# Altium schematic sheet PWR_APD5052.SchDoc: Power: DCDC
size A3; Engineer: Samer Kilani; DocumentNumber: 1; SheetNumber: 1; SheetTotal: 9
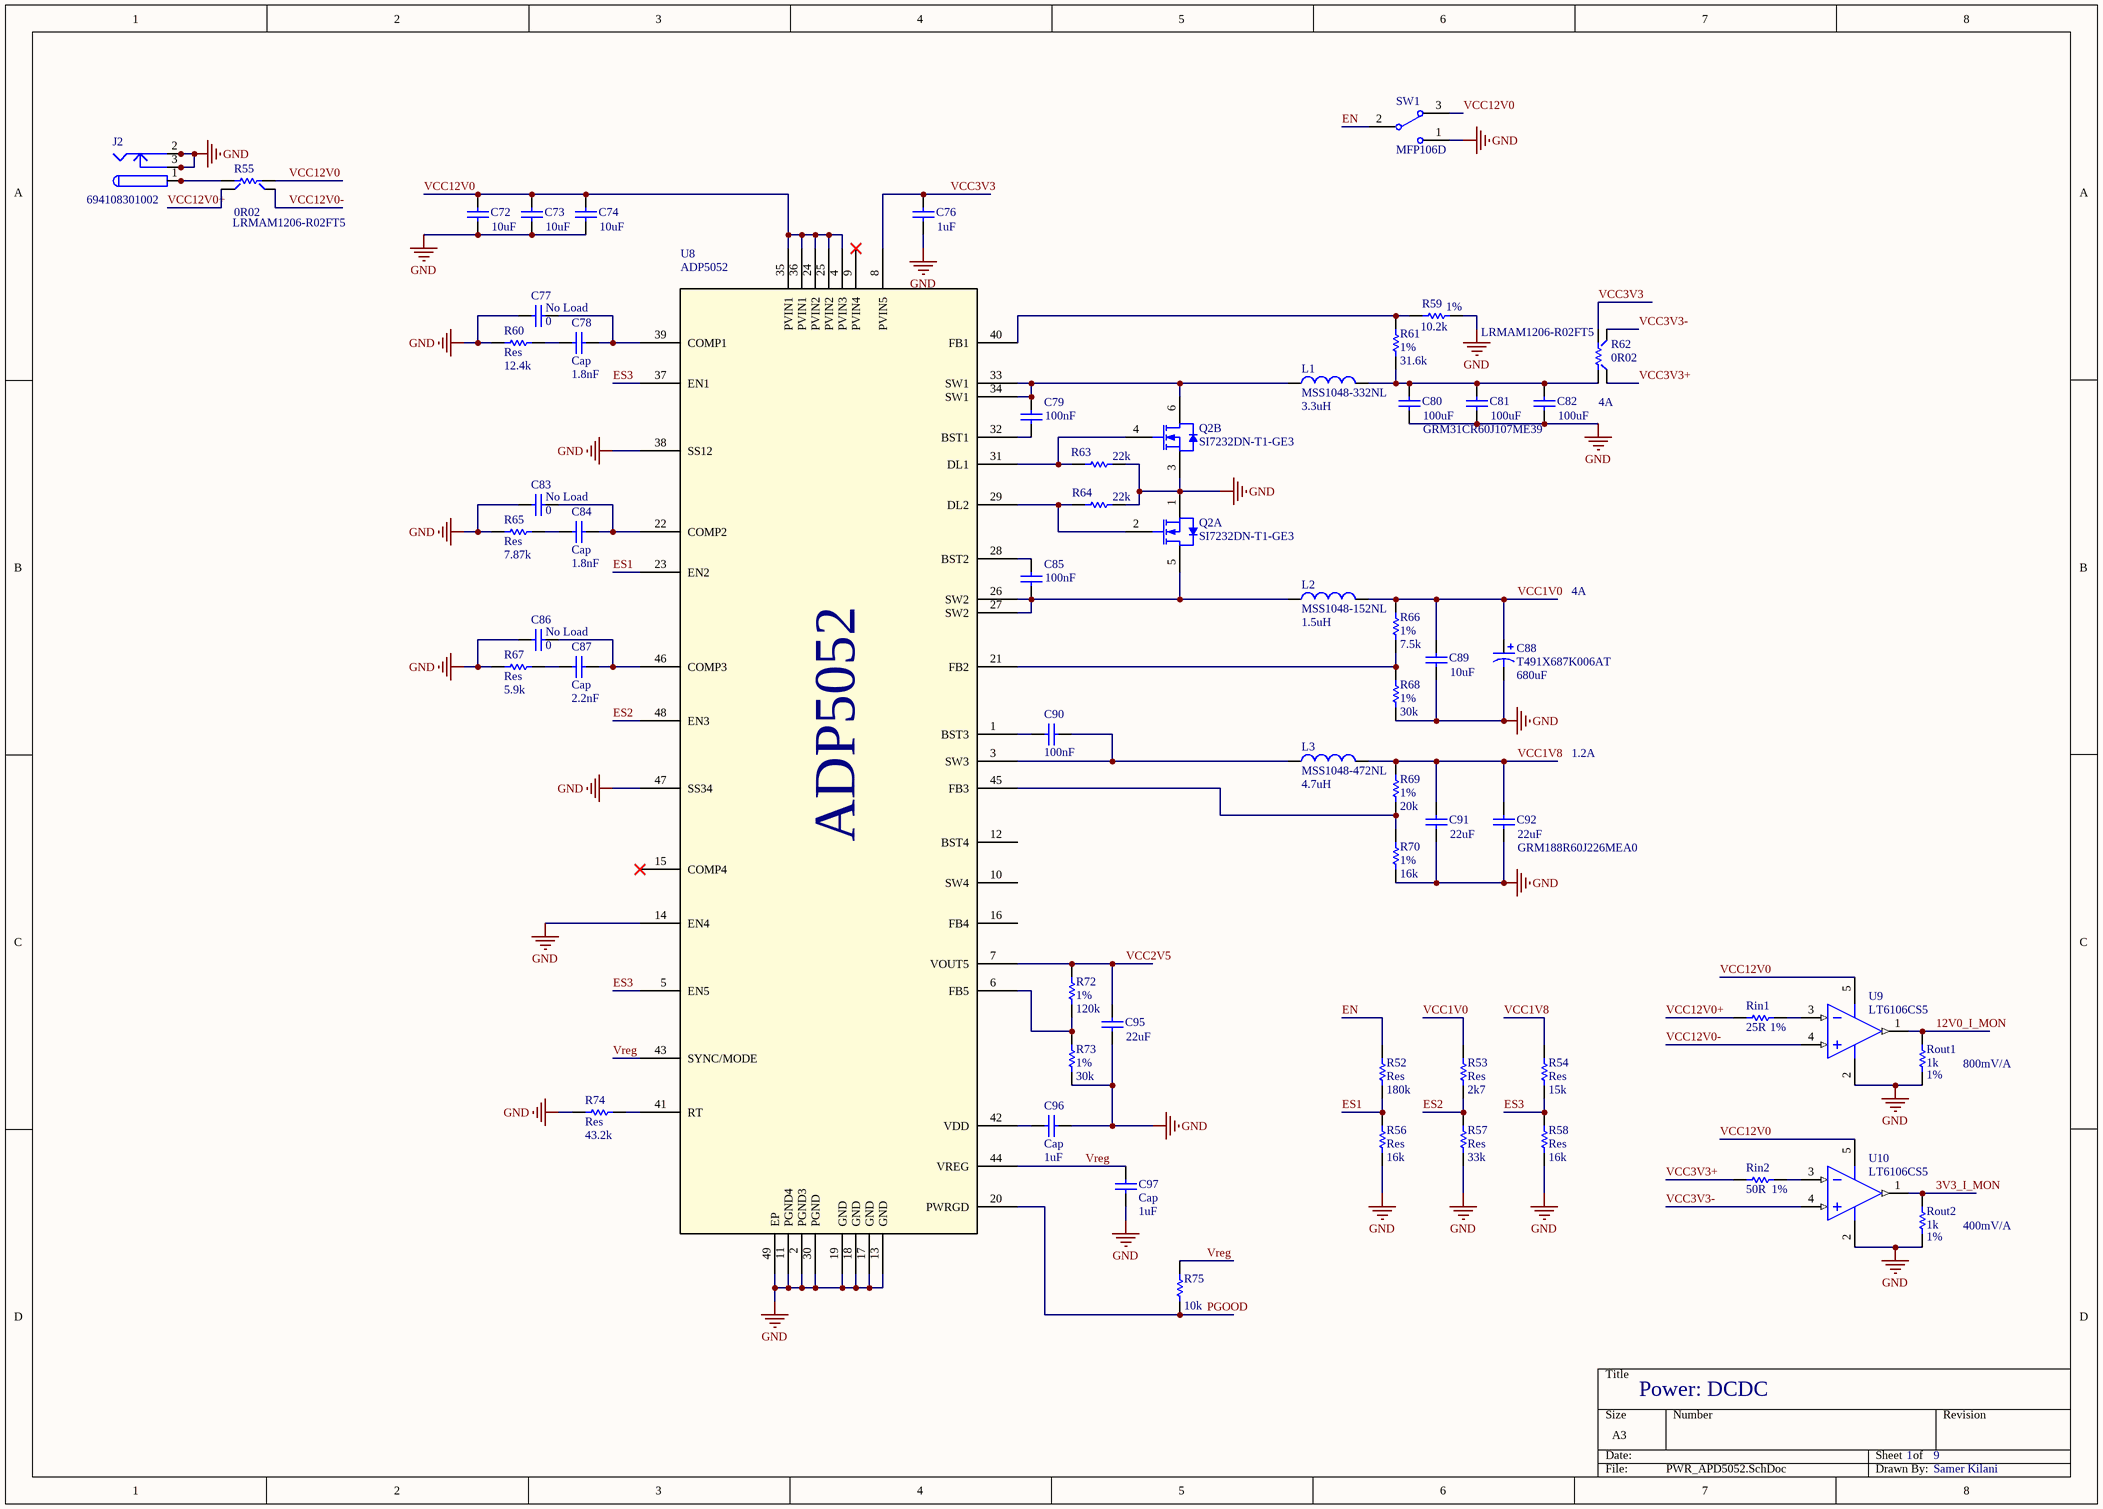
[diagram p0: PWR_APD5052.SchDoc]

## Parts
C72  value 10uF  [C0805]
C73  value 10uF  [C0805]
C74  value 10uF  [C0805]  (hidden comment: Cap)
C76  value 1uF  [C0402]
C77  No Load  value 0  [C0402]
C78  Cap  value 1.8nF  [C0402]
C79  value 100nF  [C0402]  (hidden comment: Cap)
C80  GRM31CR60J107ME39  value 100uF  [C1206]
C81  value 100uF  [C1206]  (hidden comment: GRM31CR60J107ME39)
C82  value 100uF  [C1206]  (hidden comment: GRM31CR60J107ME39)
C83  No Load  value 0  [C0402]
C84  Cap  value 1.8nF  [C0402]
C85  value 100nF  [C0402]  (hidden comment: Cap)
C86  No Load  value 0  [C0402]
C87  Cap  value 2.2nF  [C0402]
C88  T491X687K006AT  value 680uF  [C7343]
C89  value 10uF  [C0603]  (hidden comment: Cap)
C90  value 100nF  [C0402]  (hidden comment: Cap)
C91  value 22uF  [C0603]  (hidden comment: GRM188R60J226MEA0)
C92  GRM188R60J226MEA0  value 22uF  [C0603]
C95  value 22uF  [C0603]  (hidden comment: Cap)
C96  Cap  value 1uF  [C0402]
C97  Cap  value 1uF  [C0402]
J2  694108301002  [KLD-0202]
L1  MSS1048-332NL  value 3.3uH  [MSS1048]
L2  MSS1048-152NL  value 1.5uH  [MSS1048]
L3  MSS1048-472NL  value 4.7uH  [MSS1048]
Q2  SI7232DN-T1-GE3  [1212-8dual]  (parts A,B of 2)
R52  Res  value 180k  [R0402]
R53  Res  value 2k7  [R0402]
R54  Res  value 15k  [R0402]
R55  LRMAM1206-R02FT5  value 0R02  [LRMA1206]  (net tie)
R56  Res  value 16k  [R0402]
R57  Res  value 33k  [R0402]
R58  Res  value 16k  [R0402]
R59  value 10.2k  Tolerance: 1%  [R0402]  (hidden comment: Res)
R60  Res  value 12.4k  [R0402]
R61  value 31.6k  Tolerance: 1%  [R0402]  (hidden comment: Res)
R62  LRMAM1206-R02FT5  value 0R02  [LRMA1206]  (net tie)
R63  value 22k  [R0402]  (hidden comment: Res)
R64  value 22k  [R0402]  (hidden comment: Res)
R65  Res  value 7.87k  [R0402]
R66  value 7.5k  Tolerance: 1%  [R0402]  (hidden comment: Res)
R67  Res  value 5.9k  [R0402]
R68  value 30k  Tolerance: 1%  [R0402]  (hidden comment: Res)
R69  value 20k  Tolerance: 1%  [R0402]  (hidden comment: Res)
R70  value 16k  Tolerance: 1%  [R0402]  (hidden comment: Res)
R72  value 120k  Tolerance: 1%  [R0402]  (hidden comment: Res)
R73  value 30k  Tolerance: 1%  [R0402]  (hidden comment: Res)
R74  Res  value 43.2k  [R0402]
R75  value 10k  [R0402]  (hidden comment: Res)
Rin1  value 25R  Tolerance: 1%  [R0402]  (hidden comment: Res)
Rin2  value 50R  Tolerance: 1%  [R0402]  (hidden comment: Res)
Rout1  value 1k  Tolerance: 1%  [R0402]  (hidden comment: Res)
Rout2  value 1k  Tolerance: 1%  [R0402]  (hidden comment: Res)
SW1  MFP106D  [MFP106D]
U8  ADP5052  [CP_48_13]
U9  LT6106CS5  [LT-S5-5-TSOT-23_N]
U10  LT6106CS5  [LT-S5-5-TSOT-23_N]

## Nets
GND: C72.1 C73.1 C74.1 C76.1 C77.1 C80.1 C81.1 C82.1 C83.1 C86.1 C88.2 C89.1 C91.1 C92.1 C95.1 C96.1 C97.1 J2.2 J2.2A J2.2B J2.3 J2.3A J2.3B Q2.1(S1) Q2.3(S2) R56.1 R57.1 R58.1 R59.2 R60.1 R63.2 R64.2 R65.1 R67.1 R68.1 R70.1 R73.1 R74.1 Rout1.1 Rout2.1 SW1.1 U8.2(PGND3) U8.11(PGND4) U8.13(GND) U8.14(EN4) U8.17(GND) U8.18(GND) U8.19(GND) U8.30(PGND) U8.38(SS12) U8.47(SS34) U8.49(EP) U9.2(V-) U10.2(V-)
3V3_I_MON: Rout2.2 U10.1(OUT)
12V0_I_MON: Rout1.2 U9.1(OUT)
EN: R52.2 SW1.2
ES1: R52.1 R56.2 U8.23(EN2)
ES2: R53.1 R57.2 U8.48(EN3)
ES3: R54.1 R58.2 U8.5(EN5) U8.37(EN1)
PGOOD: R75.1 U8.20(PWRGD)
VCC1V0: C88.1 C89.2 L2.2 R53.2 R66.2
VCC1V8: C91.2 C92.2 L3.2 R54.2 R69.2
VCC2V5: C95.2 R72.2 U8.7(VOUT5)
VCC3V3: C76.2 R62.2 U8.8(PVIN5)
VCC3V3+: R62.3 Rin2.1
VCC3V3-: R62.4 U10.4(+IN)
VCC12V0: C72.2 C73.2 C74.2 R55.2 SW1.3 U8.4(PVIN3) U8.24(PVIN2) U8.25(PVIN2) U8.35(PVIN1) U8.36(PVIN1) U9.5(V+) U10.5(V+)
VCC12V0+: R55.3 Rin1.1
VCC12V0-: R55.4 U9.4(+IN)
Vreg: C97.2 R75.2 U8.43(SYNC/MODE) U8.44(VREG)
NetC77_2: C77.2 C78.2 U8.39(COMP1)
NetC78_1: C78.1 R60.2
NetC79_1: C79.1 U8.32(BST1)
NetC79_2: C79.2 L1.1 Q2.6(D2) U8.33(SW1) U8.34(SW1)
NetC80_2: C80.2 C81.2 C82.2 L1.2 R61.1 R62.1
NetC83_2: C83.2 C84.2 U8.22(COMP2)
NetC84_1: C84.1 R65.2
NetC85_1: C85.1 L2.1 Q2.5(D1) U8.26(SW2) U8.27(SW2)
NetC85_2: C85.2 U8.28(BST2)
NetC86_2: C86.2 C87.2 U8.46(COMP3)
NetC87_1: C87.1 R67.2
NetC90_1: C90.1 L3.1 U8.3(SW3)
NetC90_2: C90.2 U8.1(BST3)
NetC96_2: C96.2 U8.42(VDD)
NetJ2_1: J2.1 J2.1A J2.1B R55.1
NetQ2_2: Q2.2(G1) R64.1 U8.29(DL2)
NetQ2_4: Q2.4(G2) R63.1 U8.31(DL1)
NetR59_1: R59.1 R61.2 U8.40(FB1)
NetR66_1: R66.1 R68.2 U8.21(FB2)
NetR69_1: R69.1 R70.2 U8.45(FB3)
NetR72_1: R72.1 R73.2 U8.6(FB5)
NetR74_2: R74.2 U8.41(RT)
NetRin1_2: Rin1.2 U9.3(-IN)
NetRin2_2: Rin2.2 U10.3(-IN)

Not connected (* = marked no-connect by the designer): U8 9(PVIN4)* 10(SW4) 12(BST4) 15(COMP4)* 16(FB4)

## Notes on the sheet
- (near R62) 4A
- 4A
- 1.2A
- (near U8) ADP5052
- (near Rout1) 800mV/A
- (near Rout2) 400mV/A

## Library data of the parts
C72-C74 C76-C87 C89-C92 C95-C97 = Cap: Capacitor; Published: 8-Jun-2000; LatestRevisionDate: 17-Jul-2002; LatestRevisionNote: Re-released for DXP Platform.; PackageReference: RAD-0.3; Publisher: Altium Limited; PackageDescription: Radial Cap, Thru-Hole; 2 Leads; 0.3 in Pin Spacing
C88 = Cap Pol3: Polarized Capacitor (Surface Mount); Published: 8-Jun-2000; LatestRevisionDate: 29-May-2009; LatestRevisionNote: IPC-7351 Footprint Added.; PackageReference: C0805; Publisher: Altium Limited; PackageDescription: Chip Capacitor
J2 = PWR2.5: Low Voltage Power Supply Connector; Published: 17-Dec-2003; DatasheetDocument: 09-May-2002; Publisher: Altium Limited; ComponentLink1Description: Manufacturer Link; ComponentLink1URL: http://domino.kycon.com/internet/Products.html
L1-L3 = Inductor: Code_IEC: 1005; Published: 8-Jun-2000; LatestRevisionDate: 29-May-2009; LatestRevisionNote: IPC-7351 Footprint Added.; PackageReference: 0402-A; Publisher: Altium Limited; PackageDescription: Chip Inductor; Code_JEITA: 0402
R52-R54 R56-R61 R63-R70 R72-R75 Rin1 Rin2 Rout1 Rout2 = Res: Resistor
R55 R62 = Res_sense: Resistor
SW1 = SW-SPDT: SPDT Subminiature Toggle Switch, Right Angle Mounting, Vertical Actuation; Published: 24-Mar-1999; LatestRevisionDate: 17-Dec-2003; LatestRevisionNote: Schematic revised, PCB Footprint replaced.; DatasheetVersion: 05-Dec-2000; PackageReference: TL36WW15050; Publisher: Altium Limited; PackageDescription: Switch; 4 Leads; ComponentLink1Description: Manufacturer Link; ComponentLink1URL: http://www.apem.com
U8 = ADP5052ACPZ-R7: Imported; Value: Value; Type: Type; RefDes: RefDes
U9 U10 = LT6106CS5: Single Channel, Low Cost, High Side Current Sense Operational Amplifier, 0.2 MHz Typical GBW, 5-Pin SOT-23 (S5-5), Commercial; Linear Technology Part Number: LT6106; Manufacturer: Linear Technology; Channels (#): 1; GBW (MHz) Typical: 0.2; Is (mA) Typical: 0.06; Vos (mV) Guaranteed: 0.25; Vos (mV) Typical: 0.15; Vs Max (V): 36; Vs Min (V): 2.7; DatasheetVersion: Rev. A; PackageReference: LT-S5-5-TSOT-23; PackageDescription: 5-Lead Plastic TSOT-23, Body 1.63 x 2.90 mm, Pitch 0.95 mm; Type: CSA; Mounting Technology: Surface Mount; Code_JEDEC: MO-193; PartNumber: LT6106CS5; ComponentLink1Description: Manufacturer URL; ComponentLink1URL: http://www.linear.com/; ComponentLink2Description: Datasheet; ComponentLink2URL: http://cds.linear.com/docs/en/datasheet/6106fa.pdf; ComponentLink3Description: Package Specification; ComponentLink3URL: http://cds.linear.com/docs/en/packaging/SOT_5_05-08-1635.pdf